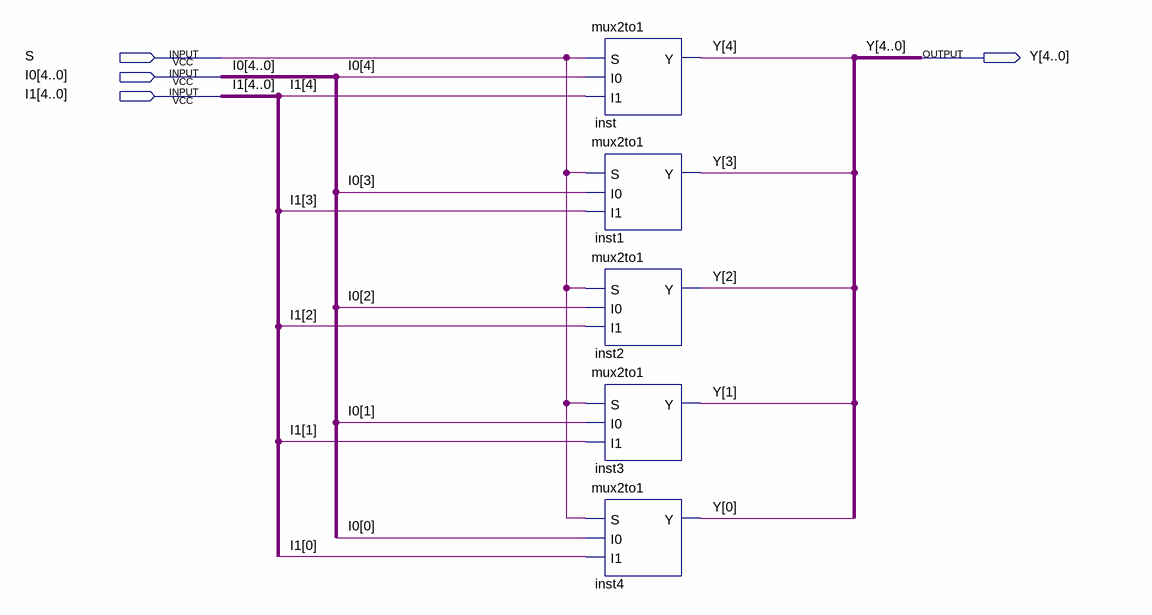
[diagram p0: schematic sheet]
// Quartus schematic mux5bit.bdf as structural Verilog: 5 symbols, 4 pins
module mux5bit (
  input  S,
  input  [4:0] I0,
  input  [4:0] I1,
  output [4:0] Y
);

  mux2to1 inst (.S(S), .I0(I0[4]), .I1(I1[4]), .Y(Y[4]));
  mux2to1 inst1 (.S(S), .I0(I0[3]), .I1(I1[3]), .Y(Y[3]));
  mux2to1 inst2 (.S(S), .I0(I0[2]), .I1(I1[2]), .Y(Y[2]));
  mux2to1 inst3 (.S(S), .I0(I0[1]), .I1(I1[1]), .Y(Y[1]));
  mux2to1 inst4 (.S(S), .I0(I0[0]), .I1(I1[0]), .Y(Y[0]));
endmodule
